# EAGLE design h_bridge_v2 (EAGLE 5.11)
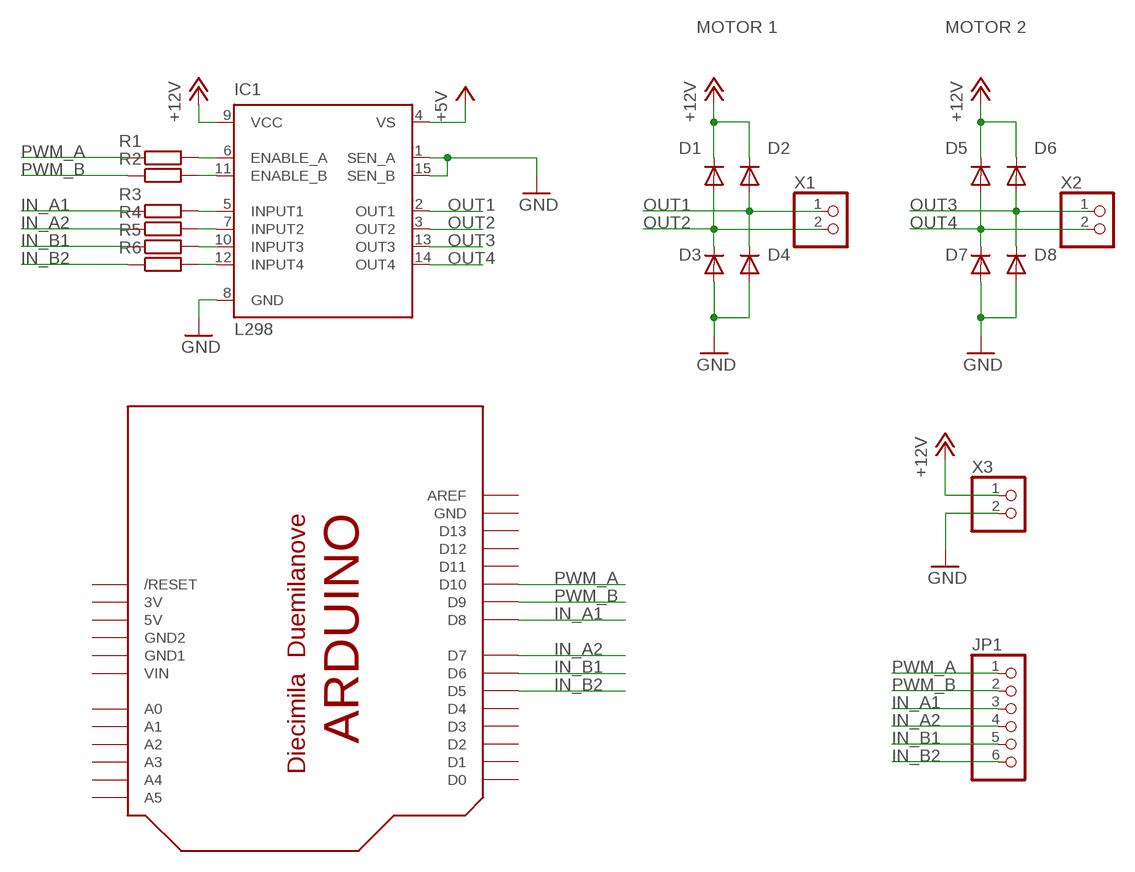
[diagram p0: schematic, sheet 1]

## Parts
D1  1N4004A  [DO41-10]
D2  1N4004A  [DO41-10]
D3  1N4004A  [DO41-10]
D4  1N4004A  [DO41-10]
D5  1N4004A  [DO41-10]
D6  1N4004A  [DO41-10]
D7  1N4004A  [DO41-10]
D8  1N4004A  [DO41-10]
IC1  L298  [MULTIWATT-15]
JP1  PINHD-1X6  [1X06]
R1  R-EU_  [0207/7]
R2  R-EU_  [0207/7]
R3  R-EU_  [0207/7]
R4  R-EU_  [0207/7]
R5  R-EU_  [0207/7]
R6  R-EU_  [0207/7]
U$1  ARDUINO-NOHOLE  [ARDUINO-NOHOLE]
X1  W237-102  [W237-102]
X2  W237-102  [W237-102]
X3  W237-102  [W237-102]

## Nets
+5V: IC1.4(VS)
+12V: D1.C D2.C D5.C D6.C IC1.9(VCC) X3.1
GND: D3.A D4.A D7.A D8.A IC1.1(SEN_A) IC1.8(GND) IC1.15(SEN_B) X3.2
IN_A1: JP1.3 R3.1 U$1.D8
IN_A2: JP1.4 R4.1 U$1.D7
IN_B1: JP1.5 R5.1 U$1.D6
IN_B2: JP1.6 R6.1 U$1.D5
N$1: IC1.6(ENABLE_A) R1.2
N$2: IC1.11(ENABLE_B) R2.2
N$3: IC1.5(INPUT1) R3.2
N$4: IC1.7(INPUT2) R4.2
N$5: IC1.10(INPUT3) R5.2
N$6: IC1.12(INPUT4) R6.2
OUT1: D2.A D4.C IC1.2(OUT1) X1.1
OUT2: D1.A D3.C IC1.3(OUT2) X1.2
OUT3: D6.A D8.C IC1.13(OUT3) X2.1
OUT4: D5.A D7.C IC1.14(OUT4) X2.2
PWM_A: JP1.1 R1.1 U$1.D10
PWM_B: JP1.2 R2.1 U$1.D9
Unconnected: U$1.A0 U$1.A1 U$1.A2 U$1.A3 U$1.A4 U$1.A5 U$1.AREF U$1.D0 U$1.D1 U$1.D2 U$1.D3 U$1.D4 U$1.D11 U$1.D12 U$1.D13 U$1.RESET(/RESET)

## Notes on the sheet
- MOTOR 1 | MOTOR 2

## Power pins joined to a net without a drawn wire
3V: U$1.3V
5V: U$1.5V
GND: U$1.GND
GND1: U$1.GND1
GND2: U$1.GND2
VIN: U$1.VIN

## Library data of the parts
D1-D8 = h_bridge_v2:1N4004: DIODE general purpose rectifier, 1 A
IC1 = h_bridge_v2:L298: DUAL FULL-BRIDGE DRIVER; MPN: L298N; OC_FARNELL: 1589425; OC_NEWARK: 32M1527
JP1 = h_bridge_v2:PINHD-1X6: PIN HEADER
R1-R6 = h_bridge_v2:R-EU_: RESISTOR, European symbol
U$1 = h_bridge_v2:ARDUINO: Arduino Diecimila/Duemilanove Make a shield with ease, this package has all the named pins as well as the two mounting drill holes and an outline of the USB and DC power connector. The outline is on the DIMENSION layer, so if your board house uses it they will cut the outline to match. http://www.ladyada.net/library/pcb/eaglelibrary.html
X1-X3 = h_bridge_v2:W237-102: WAGO SCREW CLAMP

## Board
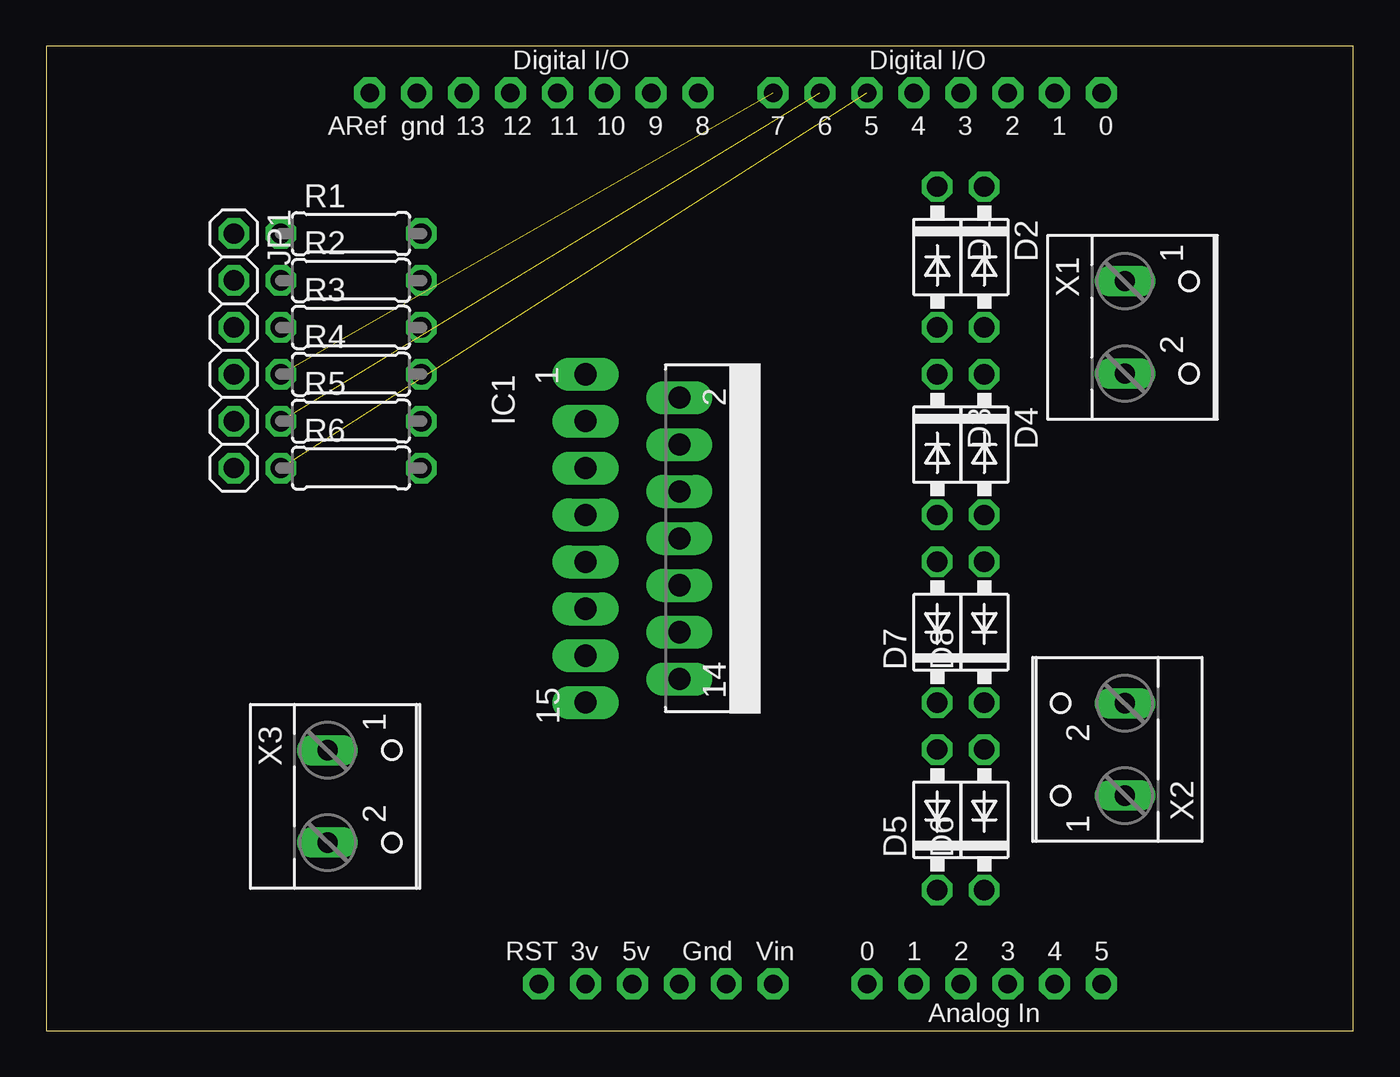
[diagram p1: board, top side]
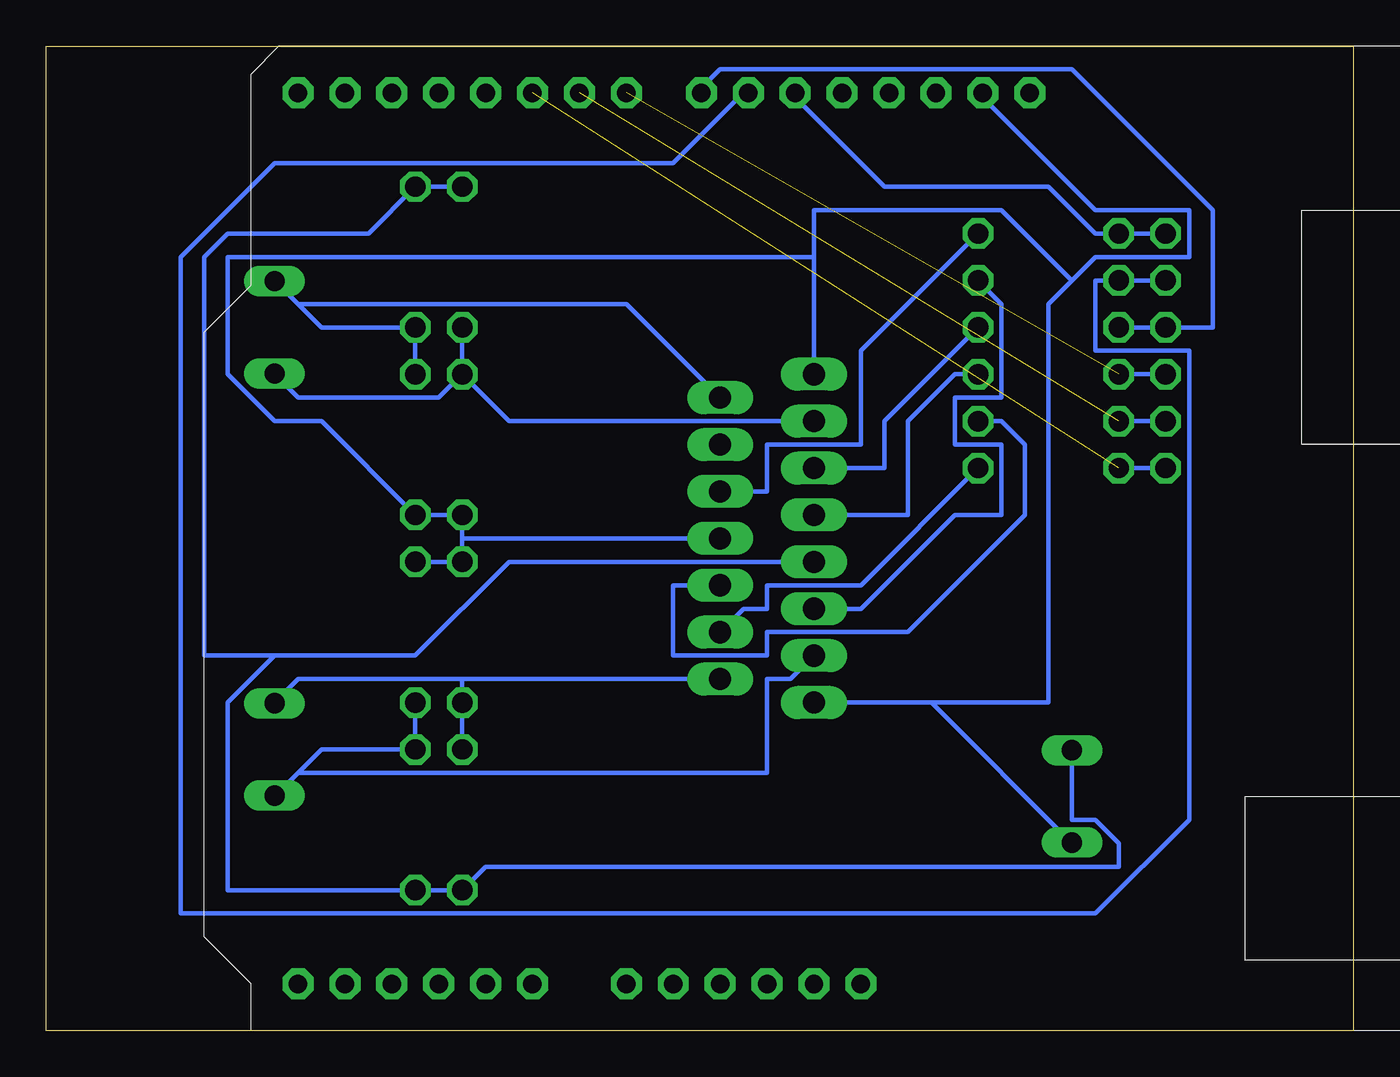
[diagram p2: board, bottom side, seen from below]

Size 70.79 x 53.33 mm. Coordinates in mm from the lower left corner, seen from the top.
Outline: 0,0 70.79,0 70.79,53.33 0,53.33 0,0
Copper layers (1*16): Top 0.035mm / dielectric 1.5mm / Bottom 0.035mm
Design rules "default": minimum track width 10mil, minimum drill 24mil, track to track 8mil, track to pad 8mil, pad to pad 8mil, via to via 8mil, smd to smd 8mil, copper to edge 40mil, drill to drill 8mil, minimum pad ring 10mil, minimum via ring 8mil, stop-mask expansion 4mil, vias tented up to drill 0mil, thermal gap 10mil

### Footprints (pad centres in the part's own frame; a part is rotated, then mirrored left to right if it is on the bottom)
DO41-10 = drill 1.1 octagon: A 3.81,0; C -3.81,0
MULTIWATT-15 = drill 1.2 long: 1 -8.89,-7.62; 2 -7.62,-2.54; 3 -6.35,-7.62; 4 -5.08,-2.54; 5 -3.81,-7.62; 6 -2.54,-2.54; 7 -1.27,-7.62; 8 0,-2.54; 9 1.27,-7.62; 10 2.54,-2.54; 11 3.81,-7.62; 12 5.08,-2.54; 13 6.35,-7.62; 14 7.62,-2.54; 15 8.89,-7.62
1X06 = drill 1.1 octagon: 1 -6.35,0; 2 -3.81,0; 3 -1.27,0; 4 1.27,0; 5 3.81,0; 6 6.35,0
0207/7 = drill 1.1 octagon: 1 -3.81,0; 2 3.81,0
ARDUINO-NOHOLE = drill 1 pad 1.676 octagon: 3V 35.56,2.54; 5V 38.1,2.54; A0 50.8,2.54; A1 53.34,2.54; A2 55.88,2.54; A3 58.42,2.54; A4 60.96,2.54; A5 63.5,2.54; AREF 23.876,50.8; D0 63.5,50.8; D1 60.96,50.8; D2 58.42,50.8; D3 55.88,50.8; D4 53.34,50.8; D5 50.8,50.8; D6 48.26,50.8; D7 45.72,50.8; D8 41.656,50.8; D9 39.116,50.8; D10 36.576,50.8; D11 34.036,50.8; D12 31.496,50.8; D13 28.956,50.8; GND 26.416,50.8; GND1 43.18,2.54; GND2 40.64,2.54; RESET 33.02,2.54; VIN 45.72,2.54
W237-102 = drill 1.1 long: 1 -2.5,-1.27; 2 2.5,-1.27

### Placement (x,y rotation side)
D1  48.26,41.91 270 top
D2  50.8,41.91 270 top
D3  48.26,31.75 270 top
D4  50.8,31.75 270 top
D5  48.26,11.43 90 top
D6  50.8,11.43 90 top
D7  48.26,21.59 90 top
D8  50.8,21.59 90 top
IC1  36.83,26.67 270 top
JP1  10.16,36.83 270 top
R1  16.51,43.18 0 top
R2  16.51,40.64 0 top
R3  16.51,38.1 0 top
R4  16.51,35.56 0 top
R5  16.51,33.02 0 top
R6  16.51,30.48 0 top
U$1  -6.35,0 0 top
X1  59.69,38.1 270 top
X2  57.15,15.24 90 top
X3  16.51,12.7 270 top

### Tracks (layer width: path | path; a pad name or v marks a point on that pad's centre or on a via)
+12V
  Bottom 0.254: D1.C D2.C 53.34,43.18 60.96,43.18 62.23,41.91 62.23,20.32 58.42,20.32 | 15.24,15.24 X3.1 15.24,11.43 13.97,11.43 12.7,10.16 12.7,8.89 46.99,8.89 D5.C D6.C 60.96,7.62 60.96,17.78 58.42,20.32 | IC1.9 45.72,25.4 50.8,20.32 58.42,20.32
GND
  Bottom 0.254: 48.26,26.67 D3.A D4.A 55.88,33.02 58.42,33.02 60.96,35.56 60.96,41.91 29.21,41.91 | 48.26,26.67 D7.A D8.A | 48.26,26.67 IC1.8 | 22.86,17.78 15.24,10.16 X3.2 | 22.86,17.78 IC1.15 | 15.24,40.64 16.51,39.37 16.51,17.78 22.86,17.78 | 15.24,40.64 13.97,41.91 8.89,41.91 8.89,44.45 13.97,44.45 20.32,50.8 U$1.GND | 29.21,41.91 29.21,44.45 19.05,44.45 15.24,40.64 | 29.21,41.91 IC1.1
IN_A1
  Bottom 0.254: R3.1 JP1.3 7.62,38.1 7.62,44.45 15.24,52.07 34.29,52.07 35.56,50.8 U$1.D8
IN_A2  (1 unrouted)
  Bottom 0.254: JP1.4 R4.1
IN_B1  (1 unrouted)
  Bottom 0.254: JP1.5 R5.1
IN_B2  (1 unrouted)
  Bottom 0.254: JP1.6 R6.1
N$1
  Bottom 0.254: R1.2 26.67,36.83 26.67,31.75 31.75,31.75 31.75,29.21 IC1.6
N$2
  Bottom 0.254: R2.2 19.05,39.37 19.05,34.29 21.59,34.29 21.59,31.75 19.05,31.75 19.05,27.94 21.59,27.94 26.67,22.86 IC1.11
N$3
  Bottom 0.254: R3.2 25.4,33.02 25.4,30.48 IC1.5
N$4
  Bottom 0.254: R4.2 21.59,35.56 24.13,33.02 24.13,27.94 IC1.7
N$5
  Bottom 0.254: R5.2 19.05,33.02 17.78,31.75 17.78,27.94 24.13,21.59 31.75,21.59 31.75,20.32 36.83,20.32 36.83,24.13 IC1.10
N$6
  Bottom 0.254: R6.2 26.67,24.13 31.75,24.13 31.75,22.86 33.02,22.86 IC1.12
OUT1
  Bottom 0.254: D4.C D2.A 55.88,38.1 57.15,39.37 | 57.15,39.37 58.42,40.64 X1.1 | IC1.2 39.37,39.37 57.15,39.37
OUT2
  Bottom 0.254: D3.C D1.A | D3.C 49.53,34.29 57.15,34.29 58.42,35.56 X1.2 | IC1.3 45.72,33.02 D3.C
OUT3
  Bottom 0.254: D8.C D6.A 55.88,15.24 57.15,13.97 | 57.15,13.97 58.42,12.7 X2.1 | IC1.13 30.48,19.05 31.75,19.05 31.75,13.97 57.15,13.97
OUT4
  Bottom 0.254: D5.A D7.C 48.26,19.05 | IC1.14 48.26,19.05 | 48.26,19.05 57.15,19.05 58.42,17.78 X2.2
PWM_A
  Bottom 0.254: JP1.1 R1.1 13.97,43.18 16.51,45.72 25.4,45.72 30.48,50.8 U$1.D10
PWM_B
  Bottom 0.254: JP1.2 R2.1 13.97,40.64 13.97,36.83 8.89,36.83 8.89,11.43 13.97,6.35 63.5,6.35 63.5,41.91 58.42,46.99 36.83,46.99 33.02,50.8 U$1.D9